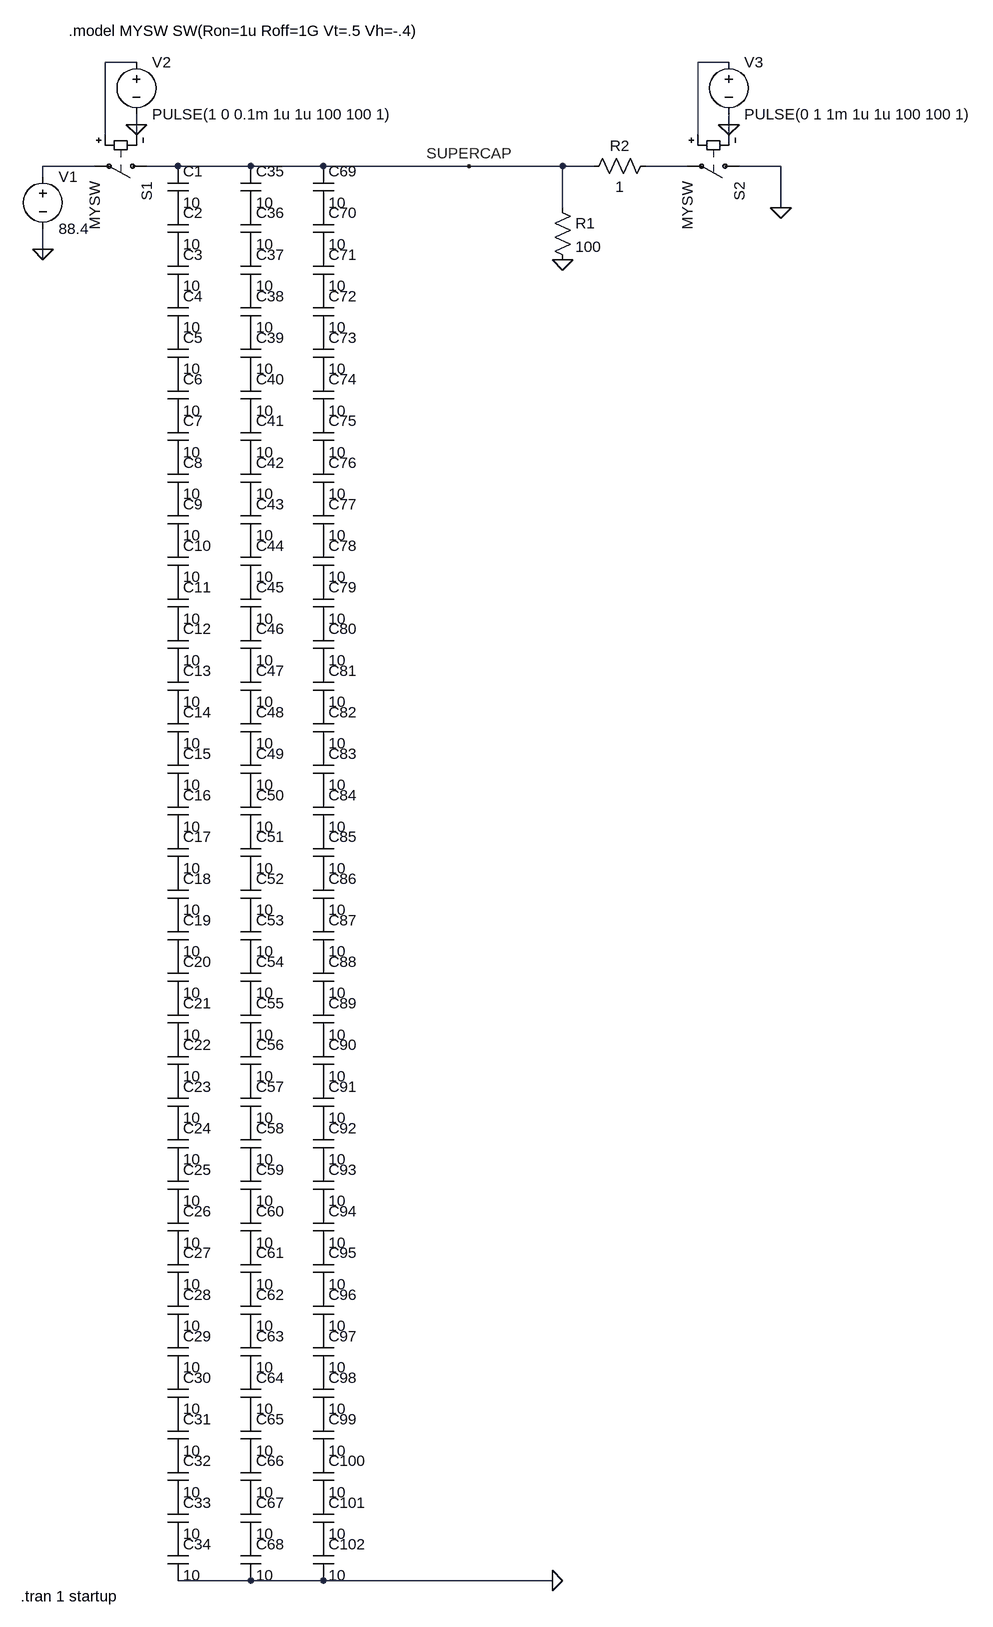
[diagram p0: schematic ESA_BOSC.asc]
ESA_BOSC.asc, the LTspice schematic file:
Version 4
SHEET 1 4904 2280
WIRE 0 -96 -48 -96
WIRE 912 -96 864 -96
WIRE 0 0 0 -16
WIRE 912 0 912 -16
WIRE -48 16 -48 -96
WIRE 0 16 0 0
WIRE 864 16 864 -96
WIRE 912 16 912 0
WIRE -64 64 -144 64
WIRE 64 64 16 64
WIRE 176 64 64 64
WIRE 288 64 176 64
WIRE 512 64 288 64
WIRE 656 64 512 64
WIRE 704 64 656 64
WIRE 848 64 784 64
WIRE 992 64 928 64
WIRE -144 80 -144 64
WIRE 656 128 656 64
WIRE 992 128 992 64
WIRE -144 192 -144 160
WIRE -144 208 -144 192
WIRE 176 2240 64 2240
WIRE 288 2240 176 2240
WIRE 640 2240 288 2240
FLAG 640 2240 0
FLAG 512 64 SUPERCAP
FLAG -144 192 0
FLAG 0 0 0
FLAG 656 208 0
FLAG 992 128 0
FLAG 912 0 0
SYMBOL cap 48 64 R0
SYMATTR InstName C1
SYMATTR Value 10
SYMBOL cap 48 128 R0
SYMATTR InstName C2
SYMATTR Value 10
SYMBOL cap 48 192 R0
SYMATTR InstName C3
SYMATTR Value 10
SYMBOL cap 48 256 R0
SYMATTR InstName C4
SYMATTR Value 10
SYMBOL cap 48 320 R0
SYMATTR InstName C5
SYMATTR Value 10
SYMBOL cap 48 384 R0
SYMATTR InstName C6
SYMATTR Value 10
SYMBOL cap 48 448 R0
SYMATTR InstName C7
SYMATTR Value 10
SYMBOL cap 48 512 R0
SYMATTR InstName C8
SYMATTR Value 10
SYMBOL cap 48 576 R0
SYMATTR InstName C9
SYMATTR Value 10
SYMBOL cap 48 640 R0
SYMATTR InstName C10
SYMATTR Value 10
SYMBOL cap 48 704 R0
SYMATTR InstName C11
SYMATTR Value 10
SYMBOL cap 48 768 R0
SYMATTR InstName C12
SYMATTR Value 10
SYMBOL cap 48 832 R0
SYMATTR InstName C13
SYMATTR Value 10
SYMBOL cap 48 896 R0
SYMATTR InstName C14
SYMATTR Value 10
SYMBOL cap 48 960 R0
SYMATTR InstName C15
SYMATTR Value 10
SYMBOL cap 48 1024 R0
SYMATTR InstName C16
SYMATTR Value 10
SYMBOL cap 48 1088 R0
SYMATTR InstName C17
SYMATTR Value 10
SYMBOL cap 48 1152 R0
SYMATTR InstName C18
SYMATTR Value 10
SYMBOL cap 48 1216 R0
SYMATTR InstName C19
SYMATTR Value 10
SYMBOL cap 48 1280 R0
SYMATTR InstName C20
SYMATTR Value 10
SYMBOL cap 48 1344 R0
SYMATTR InstName C21
SYMATTR Value 10
SYMBOL cap 48 1408 R0
SYMATTR InstName C22
SYMATTR Value 10
SYMBOL cap 48 1472 R0
SYMATTR InstName C23
SYMATTR Value 10
SYMBOL cap 48 1536 R0
SYMATTR InstName C24
SYMATTR Value 10
SYMBOL cap 48 1600 R0
SYMATTR InstName C25
SYMATTR Value 10
SYMBOL cap 48 1664 R0
SYMATTR InstName C26
SYMATTR Value 10
SYMBOL cap 48 1728 R0
SYMATTR InstName C27
SYMATTR Value 10
SYMBOL cap 48 1792 R0
SYMATTR InstName C28
SYMATTR Value 10
SYMBOL cap 48 1856 R0
SYMATTR InstName C29
SYMATTR Value 10
SYMBOL cap 48 1920 R0
SYMATTR InstName C30
SYMATTR Value 10
SYMBOL cap 48 1984 R0
SYMATTR InstName C31
SYMATTR Value 10
SYMBOL cap 48 2048 R0
SYMATTR InstName C32
SYMATTR Value 10
SYMBOL cap 48 2112 R0
SYMATTR InstName C33
SYMATTR Value 10
SYMBOL cap 48 2176 R0
SYMATTR InstName C34
SYMATTR Value 10
SYMBOL cap 160 64 R0
SYMATTR InstName C35
SYMATTR Value 10
SYMBOL cap 160 128 R0
SYMATTR InstName C36
SYMATTR Value 10
SYMBOL cap 160 192 R0
SYMATTR InstName C37
SYMATTR Value 10
SYMBOL cap 160 256 R0
SYMATTR InstName C38
SYMATTR Value 10
SYMBOL cap 160 320 R0
SYMATTR InstName C39
SYMATTR Value 10
SYMBOL cap 160 384 R0
SYMATTR InstName C40
SYMATTR Value 10
SYMBOL cap 160 448 R0
SYMATTR InstName C41
SYMATTR Value 10
SYMBOL cap 160 512 R0
SYMATTR InstName C42
SYMATTR Value 10
SYMBOL cap 160 576 R0
SYMATTR InstName C43
SYMATTR Value 10
SYMBOL cap 160 640 R0
SYMATTR InstName C44
SYMATTR Value 10
SYMBOL cap 160 704 R0
SYMATTR InstName C45
SYMATTR Value 10
SYMBOL cap 160 768 R0
SYMATTR InstName C46
SYMATTR Value 10
SYMBOL cap 160 832 R0
SYMATTR InstName C47
SYMATTR Value 10
SYMBOL cap 160 896 R0
SYMATTR InstName C48
SYMATTR Value 10
SYMBOL cap 160 960 R0
SYMATTR InstName C49
SYMATTR Value 10
SYMBOL cap 160 1024 R0
SYMATTR InstName C50
SYMATTR Value 10
SYMBOL cap 160 1088 R0
SYMATTR InstName C51
SYMATTR Value 10
SYMBOL cap 160 1152 R0
SYMATTR InstName C52
SYMATTR Value 10
SYMBOL cap 160 1216 R0
SYMATTR InstName C53
SYMATTR Value 10
SYMBOL cap 160 1280 R0
SYMATTR InstName C54
SYMATTR Value 10
SYMBOL cap 160 1344 R0
SYMATTR InstName C55
SYMATTR Value 10
SYMBOL cap 160 1408 R0
SYMATTR InstName C56
SYMATTR Value 10
SYMBOL cap 160 1472 R0
SYMATTR InstName C57
SYMATTR Value 10
SYMBOL cap 160 1536 R0
SYMATTR InstName C58
SYMATTR Value 10
SYMBOL cap 160 1600 R0
SYMATTR InstName C59
SYMATTR Value 10
SYMBOL cap 160 1664 R0
SYMATTR InstName C60
SYMATTR Value 10
SYMBOL cap 160 1728 R0
SYMATTR InstName C61
SYMATTR Value 10
SYMBOL cap 160 1792 R0
SYMATTR InstName C62
SYMATTR Value 10
SYMBOL cap 160 1856 R0
SYMATTR InstName C63
SYMATTR Value 10
SYMBOL cap 160 1920 R0
SYMATTR InstName C64
SYMATTR Value 10
SYMBOL cap 160 1984 R0
SYMATTR InstName C65
SYMATTR Value 10
SYMBOL cap 160 2048 R0
SYMATTR InstName C66
SYMATTR Value 10
SYMBOL cap 160 2112 R0
SYMATTR InstName C67
SYMATTR Value 10
SYMBOL cap 160 2176 R0
SYMATTR InstName C68
SYMATTR Value 10
SYMBOL cap 272 64 R0
SYMATTR InstName C69
SYMATTR Value 10
SYMBOL cap 272 128 R0
SYMATTR InstName C70
SYMATTR Value 10
SYMBOL cap 272 192 R0
SYMATTR InstName C71
SYMATTR Value 10
SYMBOL cap 272 256 R0
SYMATTR InstName C72
SYMATTR Value 10
SYMBOL cap 272 320 R0
SYMATTR InstName C73
SYMATTR Value 10
SYMBOL cap 272 384 R0
SYMATTR InstName C74
SYMATTR Value 10
SYMBOL cap 272 448 R0
SYMATTR InstName C75
SYMATTR Value 10
SYMBOL cap 272 512 R0
SYMATTR InstName C76
SYMATTR Value 10
SYMBOL cap 272 576 R0
SYMATTR InstName C77
SYMATTR Value 10
SYMBOL cap 272 640 R0
SYMATTR InstName C78
SYMATTR Value 10
SYMBOL cap 272 704 R0
SYMATTR InstName C79
SYMATTR Value 10
SYMBOL cap 272 768 R0
SYMATTR InstName C80
SYMATTR Value 10
SYMBOL cap 272 832 R0
SYMATTR InstName C81
SYMATTR Value 10
SYMBOL cap 272 896 R0
SYMATTR InstName C82
SYMATTR Value 10
SYMBOL cap 272 960 R0
SYMATTR InstName C83
SYMATTR Value 10
SYMBOL cap 272 1024 R0
SYMATTR InstName C84
SYMATTR Value 10
SYMBOL cap 272 1088 R0
SYMATTR InstName C85
SYMATTR Value 10
SYMBOL cap 272 1152 R0
SYMATTR InstName C86
SYMATTR Value 10
SYMBOL cap 272 1216 R0
SYMATTR InstName C87
SYMATTR Value 10
SYMBOL cap 272 1280 R0
SYMATTR InstName C88
SYMATTR Value 10
SYMBOL cap 272 1344 R0
SYMATTR InstName C89
SYMATTR Value 10
SYMBOL cap 272 1408 R0
SYMATTR InstName C90
SYMATTR Value 10
SYMBOL cap 272 1472 R0
SYMATTR InstName C91
SYMATTR Value 10
SYMBOL cap 272 1536 R0
SYMATTR InstName C92
SYMATTR Value 10
SYMBOL cap 272 1600 R0
SYMATTR InstName C93
SYMATTR Value 10
SYMBOL cap 272 1664 R0
SYMATTR InstName C94
SYMATTR Value 10
SYMBOL cap 272 1728 R0
SYMATTR InstName C95
SYMATTR Value 10
SYMBOL cap 272 1792 R0
SYMATTR InstName C96
SYMATTR Value 10
SYMBOL cap 272 1856 R0
SYMATTR InstName C97
SYMATTR Value 10
SYMBOL cap 272 1920 R0
SYMATTR InstName C98
SYMATTR Value 10
SYMBOL cap 272 1984 R0
SYMATTR InstName C99
SYMATTR Value 10
SYMBOL cap 272 2048 R0
SYMATTR InstName C100
SYMATTR Value 10
SYMBOL cap 272 2112 R0
SYMATTR InstName C101
SYMATTR Value 10
SYMBOL cap 272 2176 R0
SYMATTR InstName C102
SYMATTR Value 10
SYMBOL voltage -144 64 R0
SYMATTR InstName V1
SYMATTR Value 88.4
SYMBOL sw 32 64 R90
SYMATTR InstName S1
SYMATTR Value MYSW
SYMBOL voltage 0 -112 R0
WINDOW 123 0 0 Left 0
WINDOW 39 0 0 Left 0
SYMATTR InstName V2
SYMATTR Value PULSE(1 0 0.1m 1u 1u 100 100 1)
SYMBOL res 640 112 R0
SYMATTR InstName R1
SYMATTR Value 100
SYMBOL sw 944 64 R90
SYMATTR InstName S2
SYMATTR Value MYSW
SYMBOL res 800 48 R90
WINDOW 0 0 56 VBottom 2
WINDOW 3 32 56 VTop 2
SYMATTR InstName R2
SYMATTR Value 1
SYMBOL voltage 912 -112 R0
WINDOW 123 0 0 Left 0
WINDOW 39 0 0 Left 0
SYMATTR InstName V3
SYMATTR Value PULSE(0 1 1m 1u 1u 100 100 1)
TEXT -104 -144 Left 2 !.model MYSW SW(Ron=1u Roff=1G Vt=.5 Vh=-.4)
TEXT -178 2264 Left 2 !.tran 1 startup

The netlist it stands for:
* ESA_BOSC.asc
C1 SUPERCAP P001 10
C2 P001 P002 10
C3 P002 P003 10
C4 P003 P004 10
C5 P004 P005 10
C6 P005 P006 10
C7 P006 P007 10
C8 P007 P008 10
C9 P008 P009 10
C10 P009 P010 10
C11 P010 P011 10
C12 P011 P012 10
C13 P012 P013 10
C14 P013 P014 10
C15 P014 P015 10
C16 P015 P016 10
C17 P016 P017 10
C18 P017 P018 10
C19 P018 P019 10
C20 P019 P020 10
C21 P020 P021 10
C22 P021 P022 10
C23 P022 P023 10
C24 P023 P024 10
C25 P024 P025 10
C26 P025 P026 10
C27 P026 P027 10
C28 P027 P028 10
C29 P028 P029 10
C30 P029 P030 10
C31 P030 P031 10
C32 P031 P032 10
C33 P032 P033 10
C34 P033 0 10
C35 SUPERCAP P034 10
C36 P034 P035 10
C37 P035 P036 10
C38 P036 P037 10
C39 P037 P038 10
C40 P038 P039 10
C41 P039 P040 10
C42 P040 P041 10
C43 P041 P042 10
C44 P042 P043 10
C45 P043 P044 10
C46 P044 P045 10
C47 P045 P046 10
C48 P046 P047 10
C49 P047 P048 10
C50 P048 P049 10
C51 P049 P050 10
C52 P050 P051 10
C53 P051 P052 10
C54 P052 P053 10
C55 P053 P054 10
C56 P054 P055 10
C57 P055 P056 10
C58 P056 P057 10
C59 P057 P058 10
C60 P058 P059 10
C61 P059 P060 10
C62 P060 P061 10
C63 P061 P062 10
C64 P062 P063 10
C65 P063 P064 10
C66 P064 P065 10
C67 P065 P066 10
C68 P066 0 10
C69 SUPERCAP P067 10
C70 P067 P068 10
C71 P068 P069 10
C72 P069 P070 10
C73 P070 P071 10
C74 P071 P072 10
C75 P072 P073 10
C76 P073 P074 10
C77 P074 P075 10
C78 P075 P076 10
C79 P076 P077 10
C80 P077 P078 10
C81 P078 P079 10
C82 P079 P080 10
C83 P080 P081 10
C84 P081 P082 10
C85 P082 P083 10
C86 P083 P084 10
C87 P084 P085 10
C88 P085 P086 10
C89 P086 P087 10
C90 P087 P088 10
C91 P088 P089 10
C92 P089 P090 10
C93 P090 P091 10
C94 P091 P092 10
C95 P092 P093 10
C96 P093 P094 10
C97 P094 P095 10
C98 P095 P096 10
C99 P096 P097 10
C100 P097 P098 10
C101 P098 P099 10
C102 P099 0 10
V1 N003 0 88.4
S1 SUPERCAP N003 N001 0 MYSW
V2 N001 0 PULSE(1 0 0.1m 1u 1u 100 100 1)
R1 SUPERCAP 0 100
S2 0 N004 N002 0 MYSW
R2 N004 SUPERCAP 1
V3 N002 0 PULSE(0 1 1m 1u 1u 100 100 1)
.model MYSW SW(Ron=1u Roff=1G Vt=.5 Vh=-.4)
.tran 1 startup
.backanno
.end